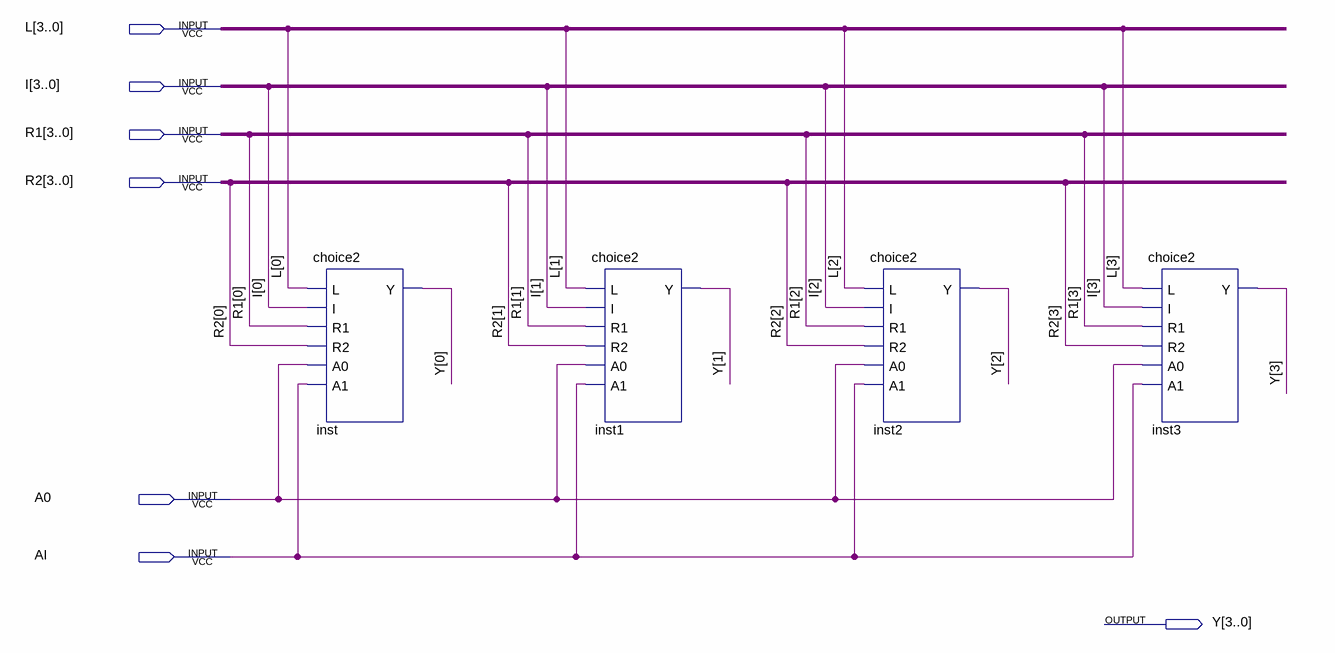
[diagram p0: schematic sheet]
// Quartus schematic Enable2.bdf as structural Verilog: 4 symbols, 7 pins
module Enable2 (
  input  [3:0] L,
  input  [3:0] I,
  input  [3:0] R1,
  input  [3:0] R2,
  input  A0,
  input  AI,
  output [3:0] Y
);

  choice2 inst (.L(L[0]), .I(I[0]), .R1(R1[0]), .R2(R2[0]), .A0(A0), .A1(AI), .Y(Y[0]));
  choice2 inst1 (.L(L[1]), .I(I[1]), .R1(R1[1]), .R2(R2[1]), .A0(A0), .A1(AI), .Y(Y[1]));
  choice2 inst2 (.L(L[2]), .I(I[2]), .R1(R1[2]), .R2(R2[2]), .A0(A0), .A1(AI), .Y(Y[2]));
  choice2 inst3 (.L(L[3]), .I(I[3]), .R1(R1[3]), .R2(R2[3]), .A0(A0), .A1(AI), .Y(Y[3]));
endmodule
